# EAGLE schematic W5500_shield (EAGLE 6.4)
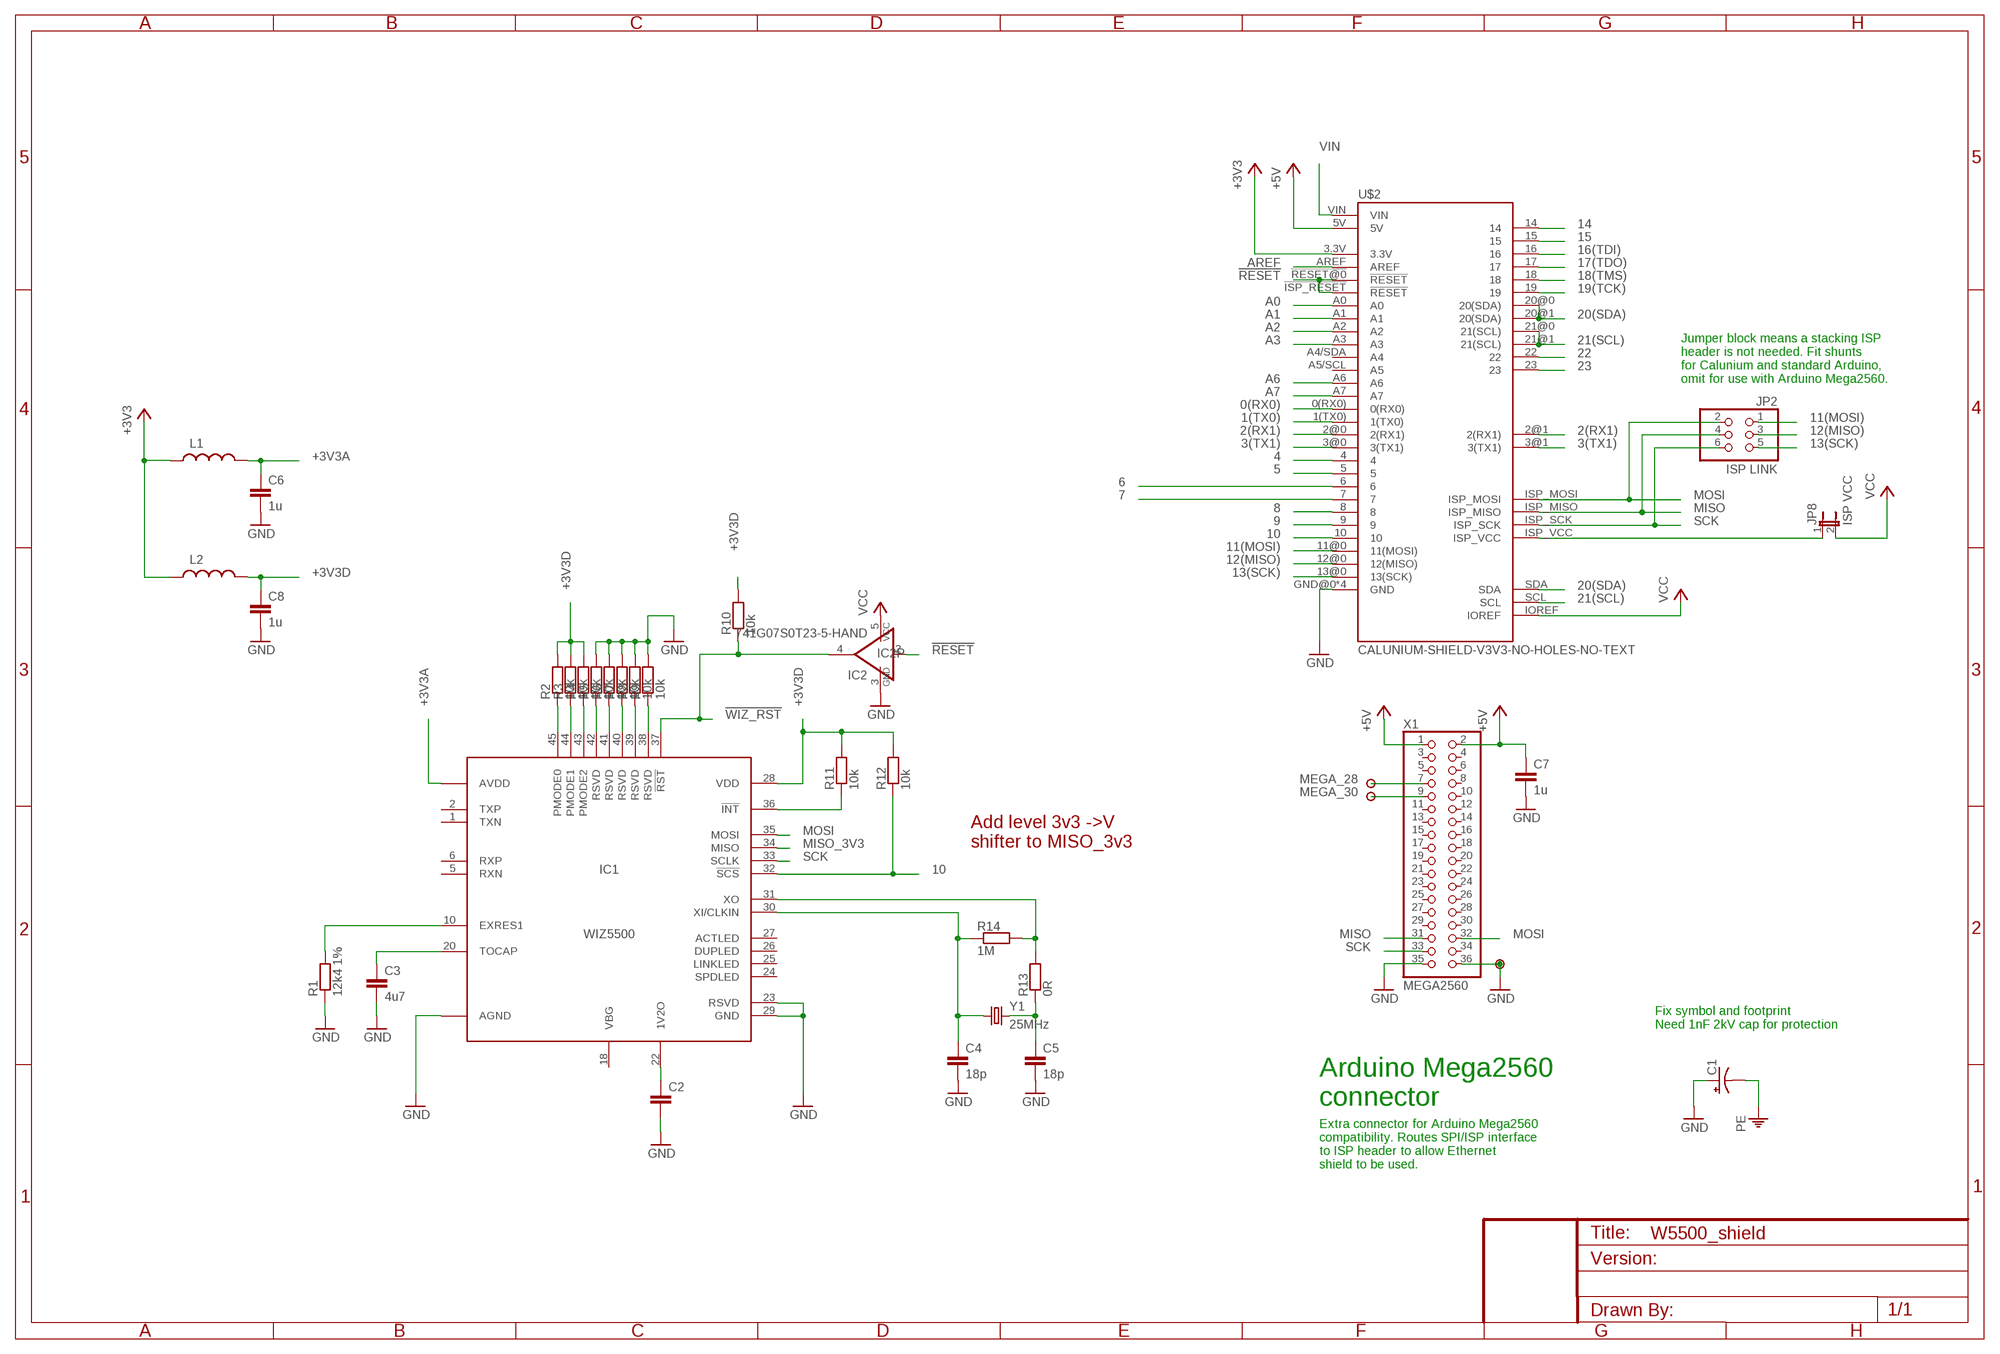
[diagram p0: schematic, sheet 1]

## Parts
C1  CAP_POL  [CPOL-RADIAL-100UF-25V-150MIL]
C2  C-EU1206-HAND  [1206-HAND]
C3  4u7  C-EU1206-HAND  [1206-HAND]
C4  18p  C-EU1206-HAND  [1206-HAND]
C5  18p  C-EU1206-HAND  [1206-HAND]
C6  1u  C-EU1206-HAND  [1206-HAND]
C7  1u  C-EU1206-HAND  [1206-HAND]
C8  1u  C-EU1206-HAND  [1206-HAND]
IC1  WIZ5500  WIZNET_W5500  [LQFP48-HAND]
IC2  741G07S0T23-5-HAND  [SOT23-5-HAND]
JP2  ISP LINK  PINHD-2X3  [2X03]
JP8  ISP VCC  JUMPER-2PTH  [1X02]
L1  INDUCTOR0805-HAND  [0805-HAND]
L2  INDUCTOR0805-HAND  [0805-HAND]
R1  12k4 1%  RESISTOR1206-HAND  [1206-HAND]
R2  10k  RESISTOR1206-HAND  [1206-HAND]
R3  10k  RESISTOR1206-HAND  [1206-HAND]
R4  10k  RESISTOR1206-HAND  [1206-HAND]
R5  10k  RESISTOR1206-HAND  [1206-HAND]
R6  10k  RESISTOR1206-HAND  [1206-HAND]
R7  10k  RESISTOR1206-HAND  [1206-HAND]
R8  10k  RESISTOR1206-HAND  [1206-HAND]
R9  10k  RESISTOR1206-HAND  [1206-HAND]
R10  10k  RESISTOR1206-HAND  [1206-HAND]
R11  10k  RESISTOR1206-HAND  [1206-HAND]
R12  10k  RESISTOR1206-HAND  [1206-HAND]
R13  0R  RESISTOR1206-HAND  [1206-HAND]
R14  1M  RESISTOR1206-HAND  [1206-HAND]
U$2  CALUNIUM-SHIELD-V3V3-NO-HOLES-NO-TEXT  [CALUNIUM-SHIELD-NO-OUTLINE-NO-HOLES-NO-TEXT-V3]
U$14  PAD  [PAD]
U$15  PAD  [PAD]
U$17  PAD  [PAD]
X1  MEGA2560  PINHD-2X18  [2X18]
Y1  25MHz  CRYSTALHC49UV  [HC49U-V]

## Nets
0(RX0): U$2.0(RX0)
1(TX0): U$2.1(TX0)
2(RX1): U$2.2@0(2(RX1)) U$2.2@1(2(RX1))
3(TX1): U$2.3@0(3(TX1)) U$2.3@1(3(TX1))
4: U$2.4
5: U$2.5
6: U$2.6
7: U$2.7
8: U$2.8
9: U$2.9
10: IC1.32(!SCS) R12.1 U$2.10
11(MOSI): JP2.1 U$2.11@0(11(MOSI))
12(MISO): JP2.3 U$2.12@0(12(MISO))
13(SCK): JP2.5 U$2.13@0(13(SCK))
14: U$2.14
15: U$2.15
16(TDI): U$2.16
17(TDO): U$2.17
18(TMS): U$2.18
19(TCK): U$2.19
20(SDA): U$2.20@0(20(SDA)) U$2.20@1(20(SDA)) U$2.SDA
21(SCL): U$2.21@0(21(SCL)) U$2.21@1(21(SCL)) U$2.SCL
22: U$2.22
23: U$2.23
!RESET: IC2.2(I) U$2.!ISP_RESET(!RESET) U$2.!RESET@0(!RESET)
!WIZ_RST: IC1.37(!RST) IC2.4(O) R10.1
+3V3: L1.1 L2.1 U$2.3.3V
+3V3A: C6.1 IC1.4(AVDD) IC1.8(AVDD) IC1.11(AVDD) IC1.15(AVDD) IC1.17(AVDD) IC1.21(AVDD) L1.2
+3V3D: C8.1 IC1.28(VDD) L2.2 R2.2 R3.2 R4.2 R10.2 R11.2 R12.2
+5V [power]: C7.1 U$2.5V X1.1 X1.2
A0: U$2.A0
A1: U$2.A1
A2: U$2.A2
A3: U$2.A3
A6: U$2.A6
A7: U$2.A7
AREF: U$2.AREF
GND: C1.1(+) C2.2 C3.2 C4.2 C5.2 C6.2 C7.2 C8.2 IC1.3(AGND) IC1.9(AGND) IC1.14(AGND) IC1.16(AGND) IC1.19(AGND) IC1.23(RSVD) IC1.29(GND) IC1.48(AGND) IC2.3(GND) R1.1 R5.2 R6.2 R7.2 R8.2 R9.2 U$2.GND@0(GND) U$2.GND@1(GND) U$2.GND@2(GND) U$2.GND@3(GND) U$17.1 X1.35 X1.36
MEGA_28: U$14.1 X1.7
MEGA_30: U$15.1 X1.9
MISO: JP2.4 U$2.ISP_MISO X1.31
MISO_3V3: IC1.34(MISO)
MOSI: IC1.35(MOSI) JP2.2 U$2.ISP_MOSI X1.32
N$1: C4.1 IC1.30(XI/CLKIN) R14.1 Y1.1
N$2: C2.1 IC1.22(1V2O)
N$3: C3.1 IC1.20(TOCAP)
N$4: IC1.10(EXRES1) R1.2
N$5: IC1.45(PMODE0) R2.1
N$6: IC1.44(PMODE1) R3.1
N$7: IC1.43(PMODE2) R4.1
N$8: IC1.42(RSVD) R5.1
N$9: IC1.41(RSVD) R6.1
N$10: IC1.40(RSVD) R7.1
N$11: IC1.39(RSVD) R8.1
N$12: IC1.38(RSVD) R9.1
N$13: IC1.31(XO) R13.2 R14.2
N$14: IC1.36(!INT) R11.1
N$16: C5.1 R13.1 Y1.2
N$17 [power]: JP8.1 U$2.ISP_VCC
PE: C1.2(-)
SCK: IC1.33(SCLK) JP2.6 U$2.ISP_SCK X1.33
VCC [power]: IC2.5(VCC) JP8.2 U$2.IOREF
VIN [power]: U$2.VIN
Unconnected: IC1.1(TXN) IC1.2(TXP) IC1.5(RXN) IC1.6(RXP) IC1.18(VBG) IC1.24(SPDLED) IC1.25(LINKLED) IC1.26(DUPLED) IC1.27(ACTLED) U$2.A4/SDA(A4) U$2.A5/SCL(A5) X1.3 X1.4 X1.5 X1.6 X1.8 X1.10 X1.11 X1.12 X1.13 X1.14 X1.15 X1.16 X1.17 X1.18 X1.19 X1.20 X1.21 X1.22 X1.23 X1.24 X1.25 X1.26 X1.27 X1.28 X1.29 X1.30 X1.34

## Notes on the sheet
- Jumper block means a stacking ISP
  header is not needed. Fit shunts
  for Calunium and standard Arduino,
  omit for use with Arduino Mega2560.
- Add level 3v3 ->V
  shifter to MISO_3v3
- Fix symbol and footprint
  Need 1nF 2kV cap for protection
- Arduino Mega2560
  connector
- Extra connector for Arduino Mega2560
  compatibility. Routes SPI/ISP interface
  to ISP header to allow Ethernet
  shield to be used.

## Library data of the parts
C1 = SteveMarple:CAP_POL: Capacitor Polarized These are standard SMD and PTH capacitors. Normally 10uF, 47uF, and 100uF in electrolytic and tantalum varieties. Always verify the external diameter of the through hole cap, it varies with capacity, voltage, and manufacturer. The EIA devices should be standard.
C2-C8 = SteveMarple:C-EU
IC1 = SteveMarple:WIZNET_W5500
IC2 = SteveMarple:74*1G07: Single Buffer/Driver With Open-Drain Output
JP2 = pinhead:PINHD-2X3: PIN HEADER
JP8 = SparkFun:JUMPER-2: Jumper Basic 0.1" spaced jumper. Use with breakaway headers.
L1 L2 = SteveMarple:INDUCTOR: Inductors Basic Inductor/Choke - 0603 and 1206. Footprints are not proven and vary greatly between part numbers.
R1-R14 = SteveMarple:RESISTOR: 1/4W PTH resistor
U$2 = SteveMarple:CALUNIUM-SHIELD-V3
U$14 U$15 U$17 = SteveMarple:PAD
X1 = pinhead:PINHD-2X18: PIN HEADER
Y1 = SteveMarple:CRYSTAL: Crystals Various standard crystals. Proven footprints. Spark Fun Electronics SKU : COM-00534

## Net classes
1 power: width 0.381 mm